# Altium project VMA_SAUVC26.PrjPcb
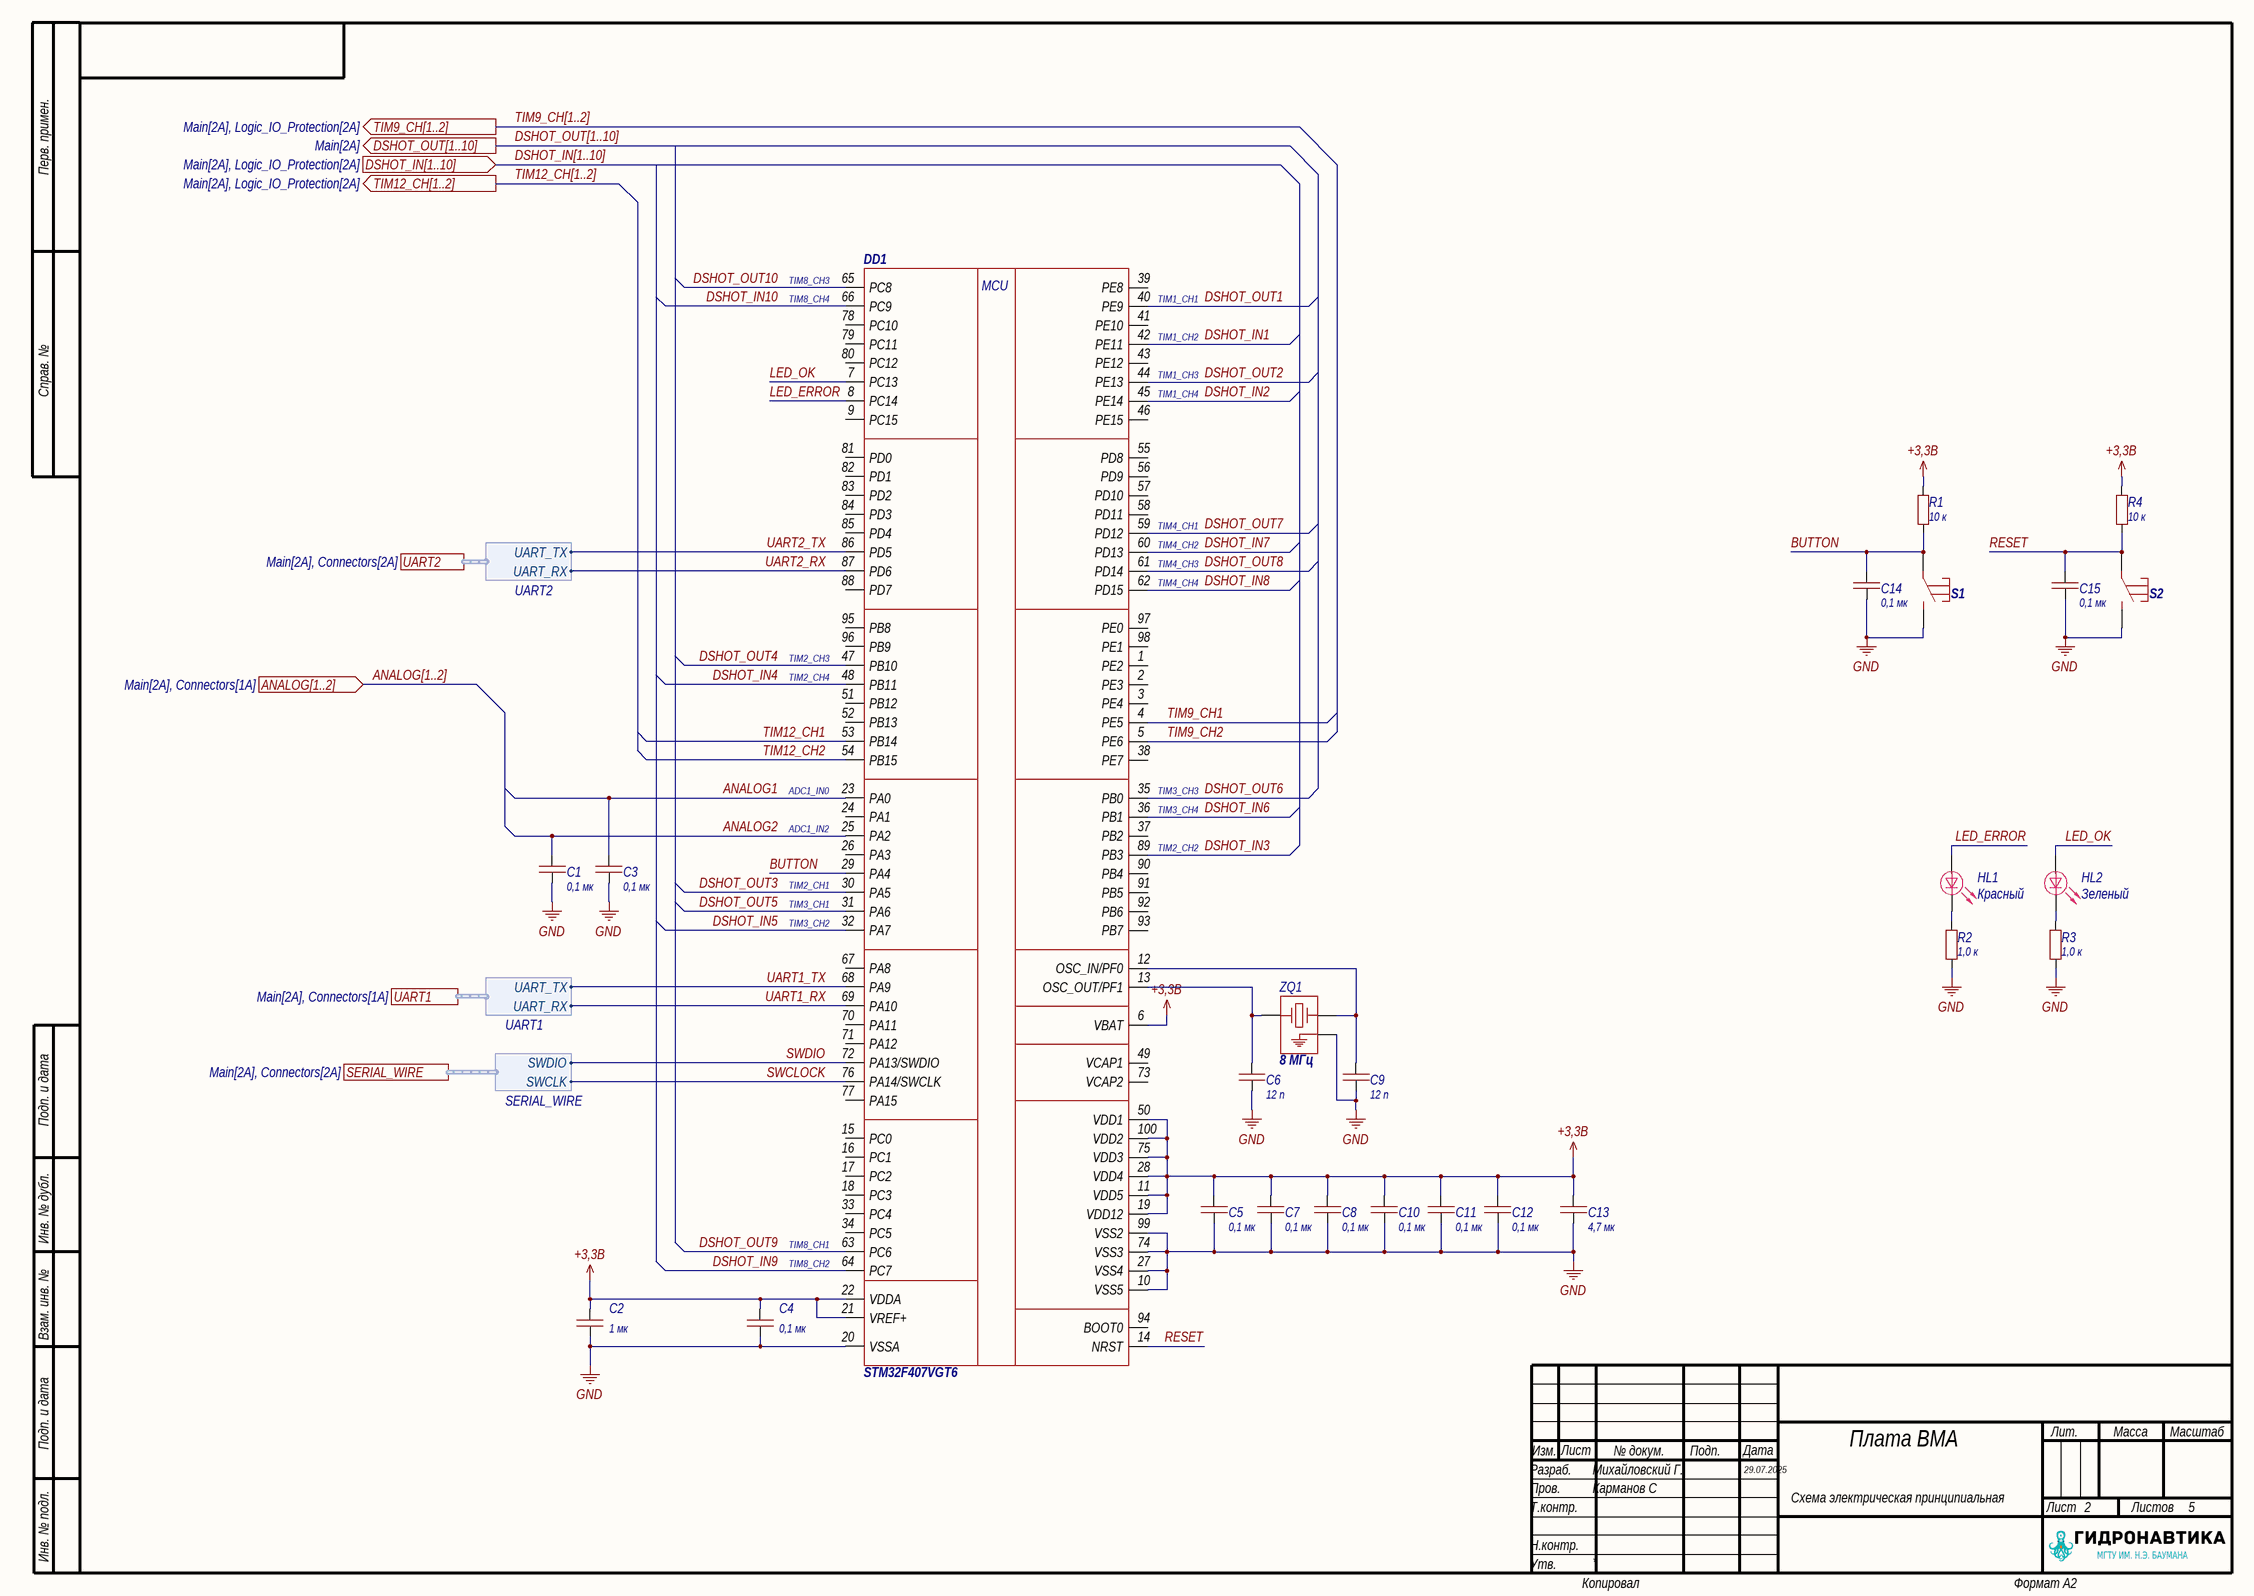
[diagram p0: MCU.SchDoc]
CheckedBy: Карманов С; Decimal_Number_PCB: ГИДР.123456.012; Decimal_Number_Shematic: ГИДР.123456.013; DrawnBy: Михайловский Г.; Release_Date: 29.07.2025; Title: Плата ВМА; Version: 01
4 sheets, 68 parts. Net scope: flat (ports and power ports of the same name join across sheets).
Board file: VMA_SAUVC26.PcbDoc
Sheets:
  MCU.SchDoc
  Connectors.SchDoc
  Logic_IO_Protection.SchDoc
  Main.SchDoc

## Sheet MCU.SchDoc: Плата ВМА
size 594 x 420 mm; SheetNumber: 2; SheetTotal: 5

### Parts
(Parts that share a designator on the sheet are numbered #1, #2 ... from top to bottom, then left to right.)
C1#1  value 0,1 мк  [0603C]  (hidden comment: Capacitor)
C2#1  value 1 мк  [0603C]  (hidden comment: Capacitor)
C3#1  value 0,1 мк  [0603C]  (hidden comment: Capacitor)
C4#1  value 0,1 мк  [0603C]  (hidden comment: Capacitor)
C5#1  value 0,1 мк  [0603C]  (hidden comment: Capacitor)
C6#1  value 12 п  [0603C]  (hidden comment: Capacitor)
C7#1  value 0,1 мк  [0603C]  (hidden comment: Capacitor)
C8#1  value 0,1 мк  [0603C]  (hidden comment: Capacitor)
C9#1  value 12 п  [0603C]  (hidden comment: Capacitor)
C10#1  value 0,1 мк  [0603C]  (hidden comment: Capacitor)
C11  value 0,1 мк  [0603C]  (hidden comment: Capacitor)
C12  value 0,1 мк  [0603C]  (hidden comment: Capacitor)
C13  value 4,7 мк  [1206C]  (hidden comment: Capacitor)
C14  value 0,1 мк  [0603C]  (hidden comment: Capacitor)
C15  value 0,1 мк  [0603C]  (hidden comment: Capacitor)
DD1#1  STM32F407VGT6  [LQFP100]
HL1#1  Color: Красный  [0805D]  (hidden comment: LED)
HL2#1  Color: Зеленый  [0805D]  (hidden comment: LED)
R1#1  value 10 к  [0603R]  (hidden comment: Resistor)
R2#1  value 1,0 к  [0603R]  (hidden comment: Resistor)
R3#1  value 1,0 к  [0603R]  (hidden comment: Resistor)
R4#1  value 10 к  [0603R]  (hidden comment: Resistor)
S1#1  TSS-TD-19XA-XTR  [TSS-TD-19XA-XTR]  (value not drawn)
S2#1  TSS-TD-19XA-XTR  [TSS-TD-19XA-XTR]  (value not drawn)
ZQ1#1  value 8 МГц  [QSMD3.2x2.5]  (hidden comment: XTAL_GND)

### Ports
ANALOG[1..2] (in, see Main[2A], Connectors[1A]), DSHOT_IN[1..10] (in, see Main[2A], Logic_IO_Protection[2A]), DSHOT_OUT[1..10] (out, see Main[2A]), SERIAL_WIRE (harness SERIAL_WIRE, see Main[2A], Connectors[2A]), TIM9_CH[1..2] (out, see Main[2A], Logic_IO_Protection[2A]), TIM12_CH[1..2] (out, see Main[2A], Logic_IO_Protection[2A]), UART1 (harness UART1, see Main[2A], Connectors[1A]), UART2 (harness UART2, see Main[2A], Connectors[2A])

### Harnesses
UART1: UART_TX, UART_RX
SERIAL_WIRE: SWDIO, SWCLK
UART2: UART_TX, UART_RX

### Nets
+3,3В: C2#1.2 C4#1.2 C5#1.2 C7#1.2 C8#1.2 C10#1.2 C11.2 C12.2 C13.2 DD1#1.6(VBAT) DD1#1.11(VDD5) DD1#1.19(VDD12) DD1#1.21(VREF+) DD1#1.22(VDDA) DD1#1.28(VDD4) DD1#1.50(VDD1) DD1#1.75(VDD3) DD1#1.100(VDD2) R1#1.2 R4#1.2
GND: C1#1.1 C2#1.1 C3#1.1 C4#1.1 C5#1.1 C6#1.1 C7#1.1 C8#1.1 C9#1.1 C10#1.1 C11.1 C12.1 C13.1 C14.1 C15.1 DD1#1.10(VSS5) DD1#1.20(VSSA) DD1#1.27(VSS4) DD1#1.74(VSS3) DD1#1.99(VSS2) R2#1.1 R3#1.1 S1#1.2 S2#1.2 ZQ1#1.3
ANALOG1: C3#1.2 DD1#1.23(PA0)
ANALOG2: C1#1.2 DD1#1.25(PA2)
BUTTON: C14.2 DD1#1.29(PA4) R1#1.1 S1#1.1
DSHOT_IN1: DD1#1.42(PE11)
DSHOT_IN2: DD1#1.45(PE14)
DSHOT_IN3: DD1#1.89(PB3)
DSHOT_IN4: DD1#1.48(PB11)
DSHOT_IN5: DD1#1.32(PA7)
DSHOT_IN6: DD1#1.36(PB1)
DSHOT_IN7: DD1#1.60(PD13)
DSHOT_IN8: DD1#1.62(PD15)
DSHOT_IN9: DD1#1.64(PC7)
DSHOT_IN10: DD1#1.66(PC9)
DSHOT_OUT1: DD1#1.40(PE9)
DSHOT_OUT2: DD1#1.44(PE13)
DSHOT_OUT3: DD1#1.30(PA5)
DSHOT_OUT4: DD1#1.47(PB10)
DSHOT_OUT5: DD1#1.31(PA6)
DSHOT_OUT6: DD1#1.35(PB0)
DSHOT_OUT7: DD1#1.59(PD12)
DSHOT_OUT8: DD1#1.61(PD14)
DSHOT_OUT9: DD1#1.63(PC6)
DSHOT_OUT10: DD1#1.65(PC8)
LED_ERROR: DD1#1.8(PC14) HL1#1.1
LED_OK: DD1#1.7(PC13) HL2#1.1
RESET: C15.2 DD1#1.14(NRST) R4#1.1 S2#1.1
SWCLOCK: DD1#1.76(PA14/SWCLK) ; port SERIAL_WIRE.SWCLK
SWDIO: DD1#1.72(PA13/SWDIO) ; port SERIAL_WIRE.SWDIO
TIM9_CH1: DD1#1.4(PE5)
TIM9_CH2: DD1#1.5(PE6)
TIM12_CH1: DD1#1.53(PB14)
TIM12_CH2: DD1#1.54(PB15)
UART1_RX: DD1#1.69(PA10) ; port UART1.UART_RX
UART1_TX: DD1#1.68(PA9) ; port UART1.UART_TX
UART2_RX: DD1#1.87(PD6) ; port UART2.UART_RX
UART2_TX: DD1#1.86(PD5) ; port UART2.UART_TX
NetC6#1_2: C6#1.2 DD1#1.13(OSC_OUT/PF1) ZQ1#1.1
NetC9#1_2: C9#1.2 DD1#1.12(OSC_IN/PF0) ZQ1#1.2
NetHL1#1_2: HL1#1.2 R2#1.2
NetHL2#1_2: HL2#1.2 R3#1.2

Not connected (* = marked no-connect by the designer): DD1#1 1(PE2) 2(PE3) 3(PE4) 9(PC15) 15(PC0) 16(PC1) 17(PC2) 18(PC3) 24(PA1) 26(PA3) 33(PC4) 34(PC5) 37(PB2) 38(PE7) 39(PE8) 41(PE10) 43(PE12) 46(PE15) 49(VCAP1) 51(PB12) 52(PB13) 55(PD8) 56(PD9) 57(PD10) 58(PD11) 67(PA8) 70(PA11) 71(PA12) 73(VCAP2) 77(PA15) 78(PC10) 79(PC11) 80(PC12) 81(PD0) 82(PD1) 83(PD2) 84(PD3) 85(PD4) 88(PD7) 90(PB4) 91(PB5) 92(PB6) 93(PB7) 94(BOOT0) 95(PB8) 96(PB9) 97(PE0) 98(PE1)

### Buses and harness runs
bus ANALOG[1..2] = port ANALOG[1..2]
bus DSHOT_IN[1..10] = port DSHOT_IN[1..10]
bus DSHOT_OUT[1..10] = port DSHOT_OUT[1..10]
bus TIM9_CH[1..2] = port TIM9_CH[1..2]
bus TIM12_CH[1..2] = port TIM12_CH[1..2]

### Notes on the sheet
- (near DD1#1) TIM8_CH3
- (near DD1#1) TIM8_CH4
- (near DD1#1) TIM1_CH1
- (near DD1#1) TIM1_CH2
- (near DD1#1) TIM1_CH3
- (near DD1#1) TIM1_CH4
- (near DD1#1) TIM4_CH1
- (near DD1#1) TIM4_CH2
- (near DD1#1) TIM4_CH3
- (near DD1#1) TIM4_CH4
- (near DD1#1) TIM2_CH3
- (near DD1#1) TIM2_CH4
- (near DD1#1) ADC1_IN0
- (near DD1#1) TIM3_CH3
- (near DD1#1) ADC1_IN2
- (near DD1#1) TIM3_CH4
- (near DD1#1) TIM2_CH1
- (near DD1#1) TIM2_CH2
- (near DD1#1) TIM3_CH1
- (near DD1#1) TIM3_CH2
- (near DD1#1) TIM8_CH1
- (near DD1#1) TIM8_CH2
- Перв. примен.
- Справ. №
- Подп. и дата
- Инв. № дубл.
- Взам. инв. №
- Разраб.
- Изм.
- Лист
- № докум.
- Подп.
- Дата
- Лит.
- Масса
- Масштаб
- Пров.
- Т.контр.
- Схема электрическая принципиальная
- Листов
- Инв. № подл.
- Утв.
- Н.контр.
- Копировал
- Формат А2
- (in symbol STM32F407VGT6) MCU

### Library data of the parts
C1#1 C3#1 C4#1 C5#1 C7#1 C8#1 C10#1 C11 C12 C14 C15 = Capacitor_0,1u_10_50V_X7R_0603C: Конденсатор; Library Path2: Schematic\Capacitor.SchLib; Tolerance: 0,1; Voltage (V): 50; Dielectric: X7R; Capacity (nF): 100; Part Number: Capacitor_0,1u_10_50V_X7R_0603C
C2#1 = Capacitor_1u_10_50V_X7R_0603C: Конденсатор; Library Path2: Schematic\Capacitor.SchLib; Tolerance: 0,1; Voltage (V): 50; Dielectric: X7R; Capacity (nF): 1000; Part Number: Capacitor_1u_10_50V_X7R_0603C
C6#1 C9#1 = 0,1 мк: Конденсатор 12п; Part Number: Capacitor
C13 = Capacitor_4,7u_10_50V_X7R_1206C: Конденсатор; Library Path2: Schematic\Capacitor.SchLib; Tolerance: 0,1; Voltage (V): 50; Dielectric: X7R; Capacity (nF): 4700; Part Number: Capacitor_4,7u_10_50V_X7R_1206C
DD1#1 = STM32F407VGT6: Микроконтроллер; Part Number: STM32F407VGT6
HL1#1 HL2#1 = LED: Светодиод; Part Number: LED
R1#1 R4#1 = Resistor_10k_1_0603: Резистор номиналом 10 кОм и точностью 1%; Power: *; Part Number: Resistor_10k_1_0603; Tolerance: 1%
R2#1 R3#1 = Resistor_1.0k_1_0603: Резистор номиналом 1,0 кОм и точностью 1%; Power: *; Part Number: Resistor_1.0k_1_0603; Tolerance: 1%
S1#1 S2#1 = TSS-TD-19XA-XTR: Тактовая кнопка; Part Number: TSS-TD-19XA-XTR
ZQ1#1 = XTAL_GND: Кварцевый резонатор с входом земли; Part Number: XTAL_GND

## Sheet Connectors.SchDoc: Плата ВМА
size 420 x 297 mm; SheetNumber: 3; SheetTotal: 5
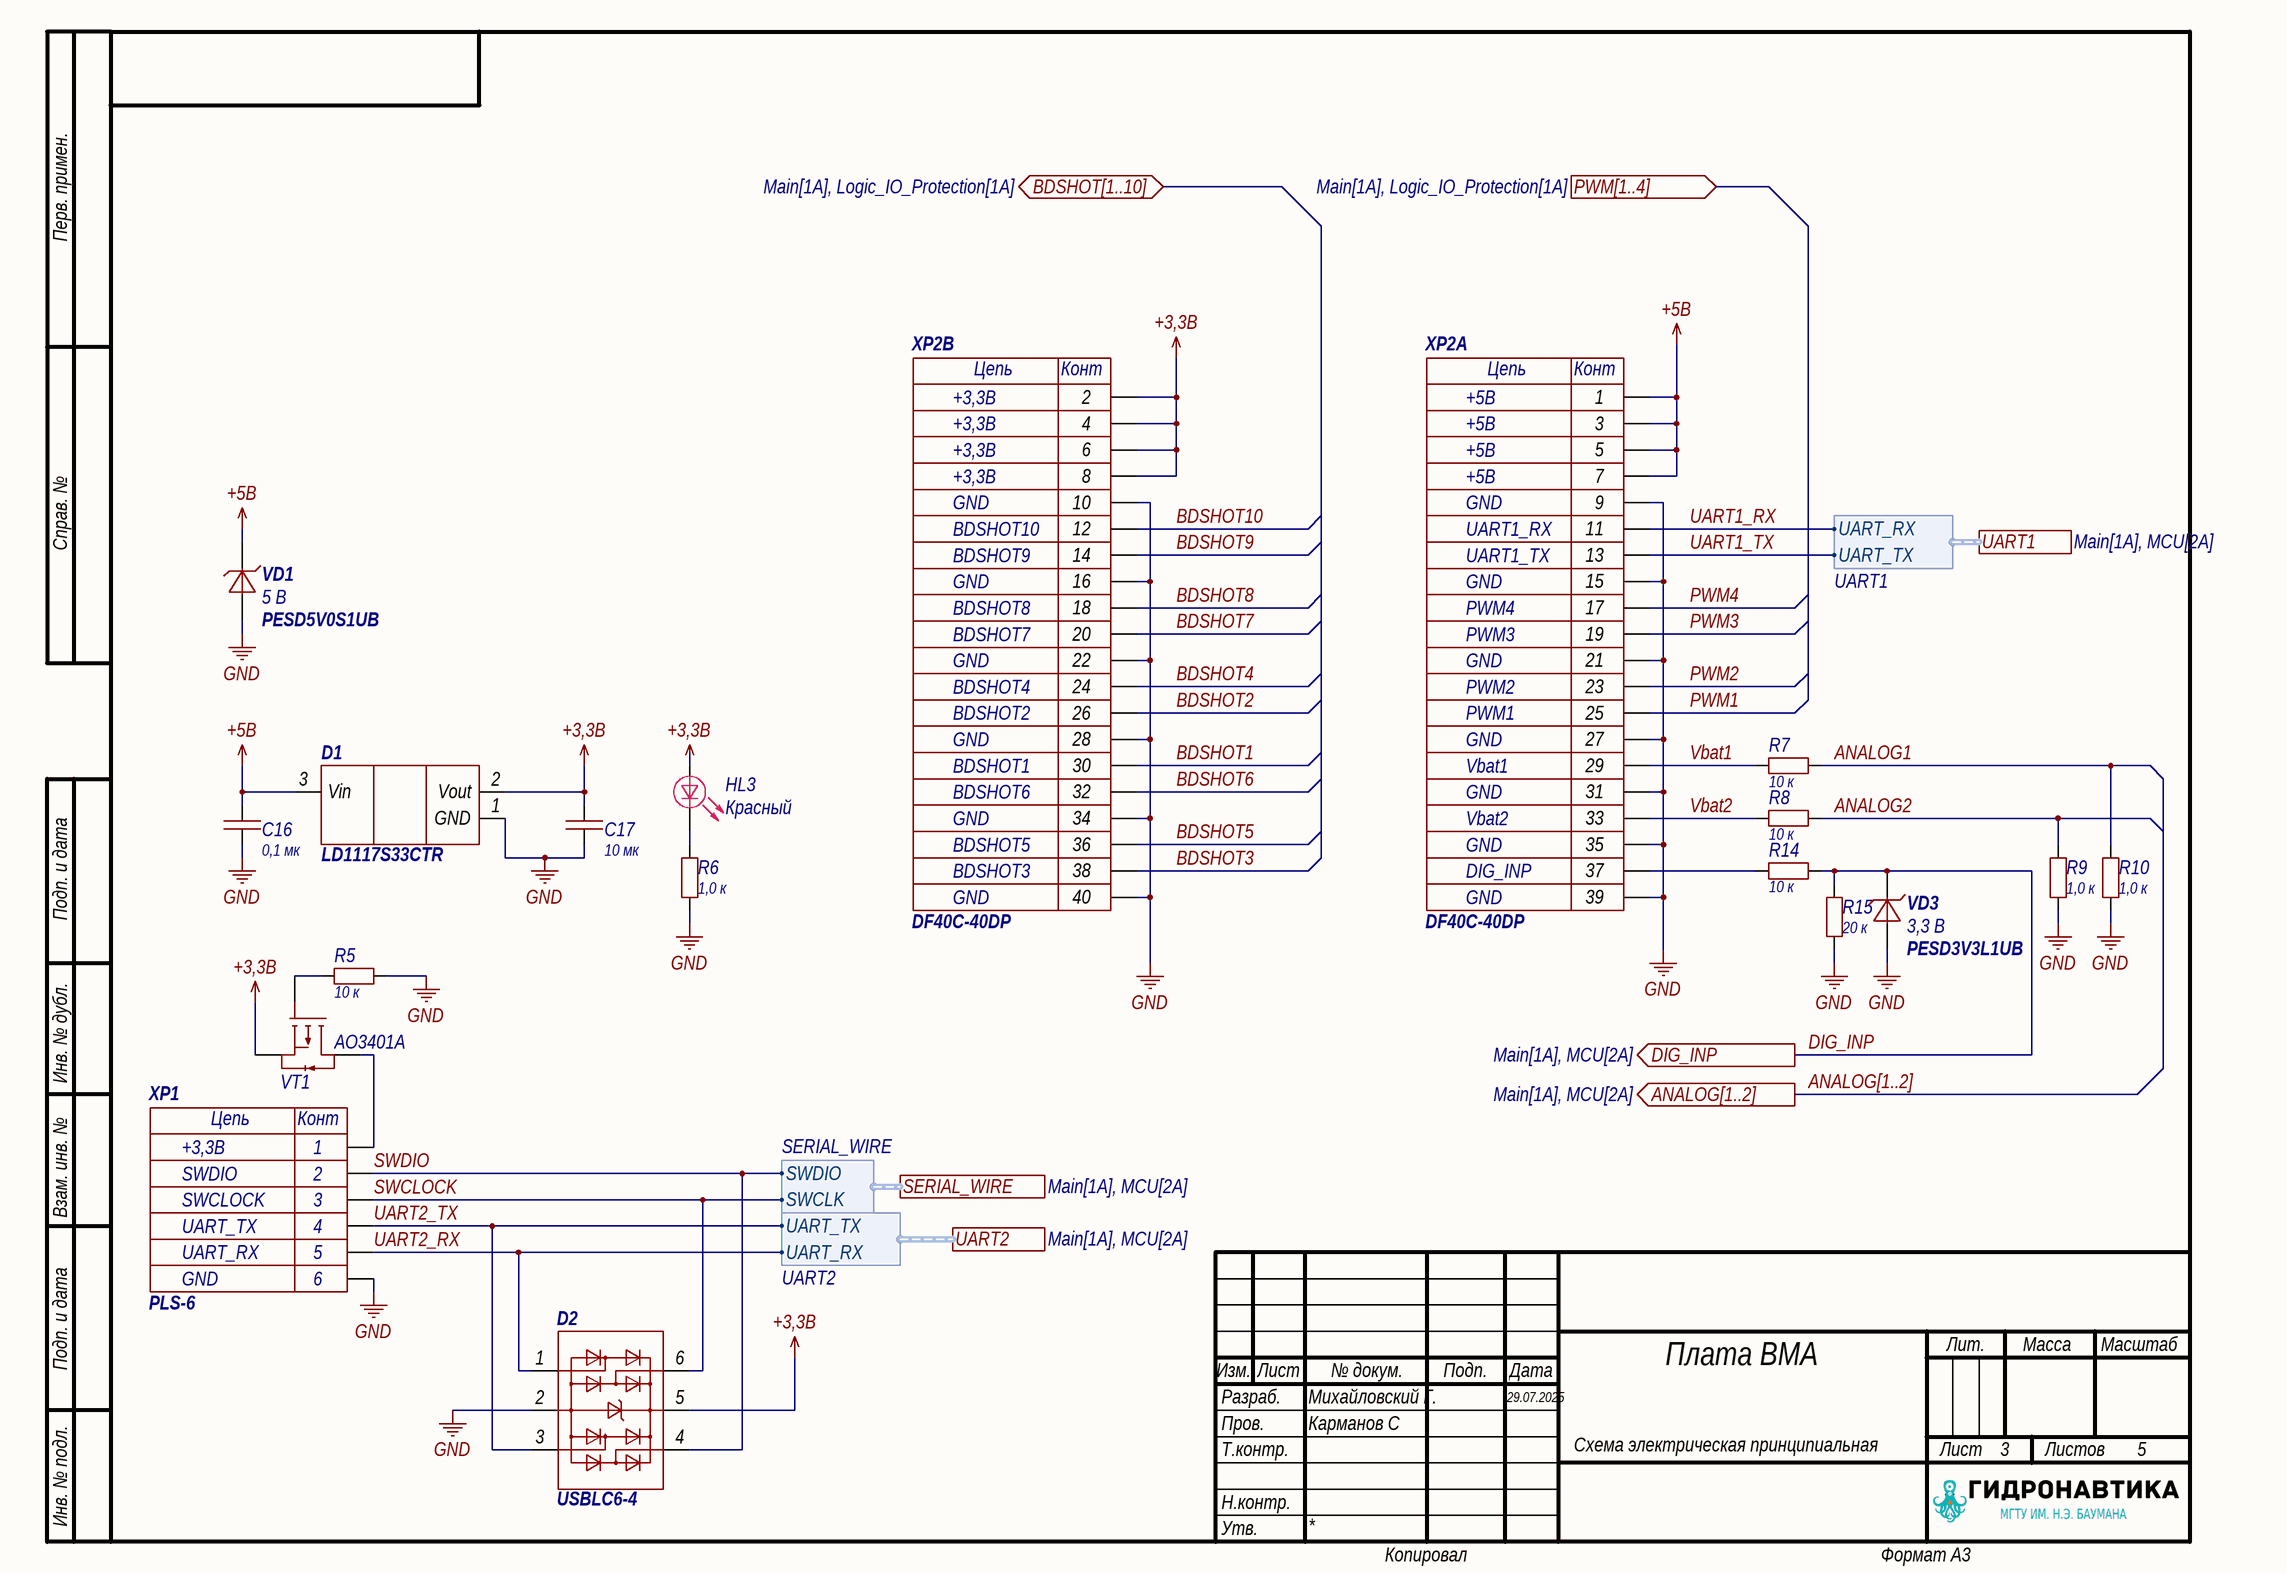
[diagram p1: Connectors.SchDoc]

### Parts
(Parts that share a designator on the sheet are numbered #1, #2 ... from top to bottom, then left to right.)
C16  value 0,1 мк  [0603C]  (hidden comment: Capacitor)
C17  value 10 мк  [1210C]  (hidden comment: Capacitor)
D1#1  LD1117S33CTR  [SOT223]
D2  USBLC6-4  [SOT23-6]
HL3  Color: Красный  [0805D]  (hidden comment: LED)
R5#1  value 10 к  [0603R]  (hidden comment: Resistor)
R6  value 1,0 к  [0603R]  (hidden comment: Resistor)
R7  value 10 к  [0603R]  (hidden comment: Resistor)
R8  value 10 к  [0603R]  (hidden comment: Resistor)
R9  value 1,0 к  [0603R]  (hidden comment: Resistor)
R10  value 1,0 к  [0603R]  (hidden comment: Resistor)
R14  value 10 к  [0603R]  (hidden comment: Resistor)
R15  value 20 к  [0603R]  (hidden comment: Resistor)
VD1  PESD5V0S1UB  value 5 В  [SOD523]
VD3  PESD3V3L1UB  value 3,3 В  [SOD523]
VT1  AO3401A  [SOT23-3]
XP1  PLS-6  Value1: +3,3В  Value2: SWDIO  Value3: SWCLOCK  Value4: UART_TX  Value5: UART_RX  Value6: GND  [PLS6]
XP2  DF40C-40DP  Value17: Vbat2  Value20: GND  Value19: DIG_INP  Value15: Vbat1  Value13: PWM1  Value12: PWM2  Value10: PWM3  Value9: PWM4  Value7: UART1_TX  Value6: UART1_RX  Value4: +5В  [DF40C-40DP]  (parts A,B of 2)

### Ports
ANALOG[1..2] (out, see Main[1A], MCU[2A]), BDSHOT[1..10] (bidir, see Main[1A], Logic_IO_Protection[1A]), DIG_INP (out, see Main[1A], MCU[2A]), PWM[1..4] (in, see Main[1A], Logic_IO_Protection[1A]), SERIAL_WIRE (harness SERIAL_WIRE, see Main[1A], MCU[2A]), UART1 (harness UART1, see Main[1A], MCU[2A]), UART2 (harness UART2, see Main[1A], MCU[2A])

### Harnesses
SERIAL_WIRE: SWDIO, SWCLK
UART2: UART_TX, UART_RX
UART1: UART_RX, UART_TX

### Nets
+3,3В: C17.2 D1#1.2(Vout) D2.5 HL3.1 VT1.2 XP2.2 XP2.4 XP2.6 XP2.8
+5В: C16.2 D1#1.3(Vin) VD1.2 XP2.1 XP2.3 XP2.5 XP2.7
GND: C16.1 C17.1 D1#1.1(GND) D2.2 R5#1.1 R6.1 R9.1 R10.1 R15.1 VD1.1 VD3.1 XP1.6 XP2.9 XP2.10 XP2.15 XP2.16 XP2.21 XP2.22 XP2.27 XP2.28 XP2.31 XP2.34 XP2.35 XP2.39 XP2.40
ANALOG1: R7.2 R10.2
ANALOG2: R8.2 R9.2
BDSHOT1: XP2.30
BDSHOT2: XP2.26
BDSHOT3: XP2.38
BDSHOT4: XP2.24
BDSHOT5: XP2.36
BDSHOT6: XP2.32
BDSHOT7: XP2.20
BDSHOT8: XP2.18
BDSHOT9: XP2.14
BDSHOT10: XP2.12
DIG_INP: R14.2 R15.2 VD3.2 ; port DIG_INP
PWM1: XP2.25
PWM2: XP2.23
PWM3: XP2.19
PWM4: XP2.17
SWCLOCK: D2.6 XP1.3 ; port SERIAL_WIRE.SWCLK
SWDIO: D2.4 XP1.2 ; port SERIAL_WIRE.SWDIO
UART1_RX: XP2.11 ; port UART1.UART_RX
UART1_TX: XP2.13 ; port UART1.UART_TX
UART2_RX: D2.1 XP1.5 ; port UART2.UART_RX
UART2_TX: D2.3 XP1.4 ; port UART2.UART_TX
Vbat1: R7.1 XP2.29
Vbat2: R8.1 XP2.33
NetHL3_2: HL3.2 R6.2
NetR5#1_2: R5#1.2 VT1.1
NetR14_1: R14.1 XP2.37
NetVT1_3: VT1.3 XP1.1

### Buses and harness runs
bus ANALOG[1..2] = port ANALOG[1..2]

### Notes on the sheet
- Перв. примен.
- Справ. №
- Подп. и дата
- Инв. № дубл.
- Взам. инв. №
- Разраб.
- Изм.
- Лист
- № докум.
- Подп.
- Дата
- Лит.
- Масса
- Масштаб
- Пров.
- Т.контр.
- Схема электрическая принципиальная
- Листов
- Инв. № подл.
- Утв.
- Н.контр.
- Копировал
- Формат А3
- (in symbol DF40C-40DP, part A) Цепь; Конт
- (in symbol DF40C-40DP, part B) Цепь; Конт
- (in symbol PLS-6) Цепь; Конт

### Library data of the parts
C16 = Capacitor_0,1u_10_50V_X7R_0603C: as C1#1 on sheet MCU; Part Number: Capacitor_0,1u_10_50V_X7R_0603C
C17 = Capacitor_10u_10_35V_X7R_1210C: Конденсатор; Library Path2: Schematic\Capacitor.SchLib; Tolerance: 0,1; Voltage (V): 35; Dielectric: X7R; Capacity (nF): 10000; Part Number: Capacitor_10u_10_35V_X7R_1210C
D1#1 = LD1117S33CTR: Линейный стабилизатор напряжения; Part Number: LD1117S33CTR
D2 = USBLC6-4: Сборка защитных диодов для USB; ComponentLink1Description: Shop; ComponentLink1URL: https://www.chipdip.ru/product0/8001780508; Part Number: USBLC6-4
HL3 = LED: Светодиод; Part Number: LED
R5#1 R7 R8 = Resistor_10k_1_0603: Резистор номиналом 10 кОм и точностью 1%; Power: *; Part Number: Resistor_10k_1_0603; Tolerance: 1%
R6 R9 R10 = Resistor_1.0k_1_0603: as R2#1 on sheet MCU; Power: *; Part Number: Resistor_1.0k_1_0603; Tolerance: 1%
R14 = Resistor_10k_1_0603: Резистор номиналом 10 кОм 1%; Power: *; Part Number: Resistor_10k_1_0603; Tolerance: 1%
R15 = Resistor_20k_1_0603: Резистор номиналом 20 кОм 1%; Power: *; Part Number: Resistor_20k_1_0603; Tolerance: 1%
VD1 = PESD5V0S1UB: Защитный диод на 5 В, рассеиваемая мощность 330 Вт; Voltage nominal (V): 5; Power (W): 330; Part Number: PESD5V0S1UB
VD3 = PESD3V3L1UB: Защитный диод на 3,3 В, рассеиваемая мощность 45 Вт; Voltage nominal (V): 3,3; Power (W): 45; Автор: glebmih; Part Number: PESD3V3L1UB
VT1 = AO3401A: P-канальный MOSFET; Part Number: AO3401A
XP1 = PLS-6: Гребенка 6 пинов; System: Connector; Part Number: PLS-6
XP2 = DF40C-40DP: Разъем плата-плата 40 пинов, мама, шаг 0.4мм; System: Connector; Value18: GND; Value16: GND; Value14: GND; Value11: GND; Value8: GND; Value5: GND; Value3: +5В; Value2: +5В; Value1: +5В; Part Number: DF40C-40DP

## Sheet Logic_IO_Protection.SchDoc: Плата ВМА
size 420 x 297 mm; SheetNumber: 4; SheetTotal: 5
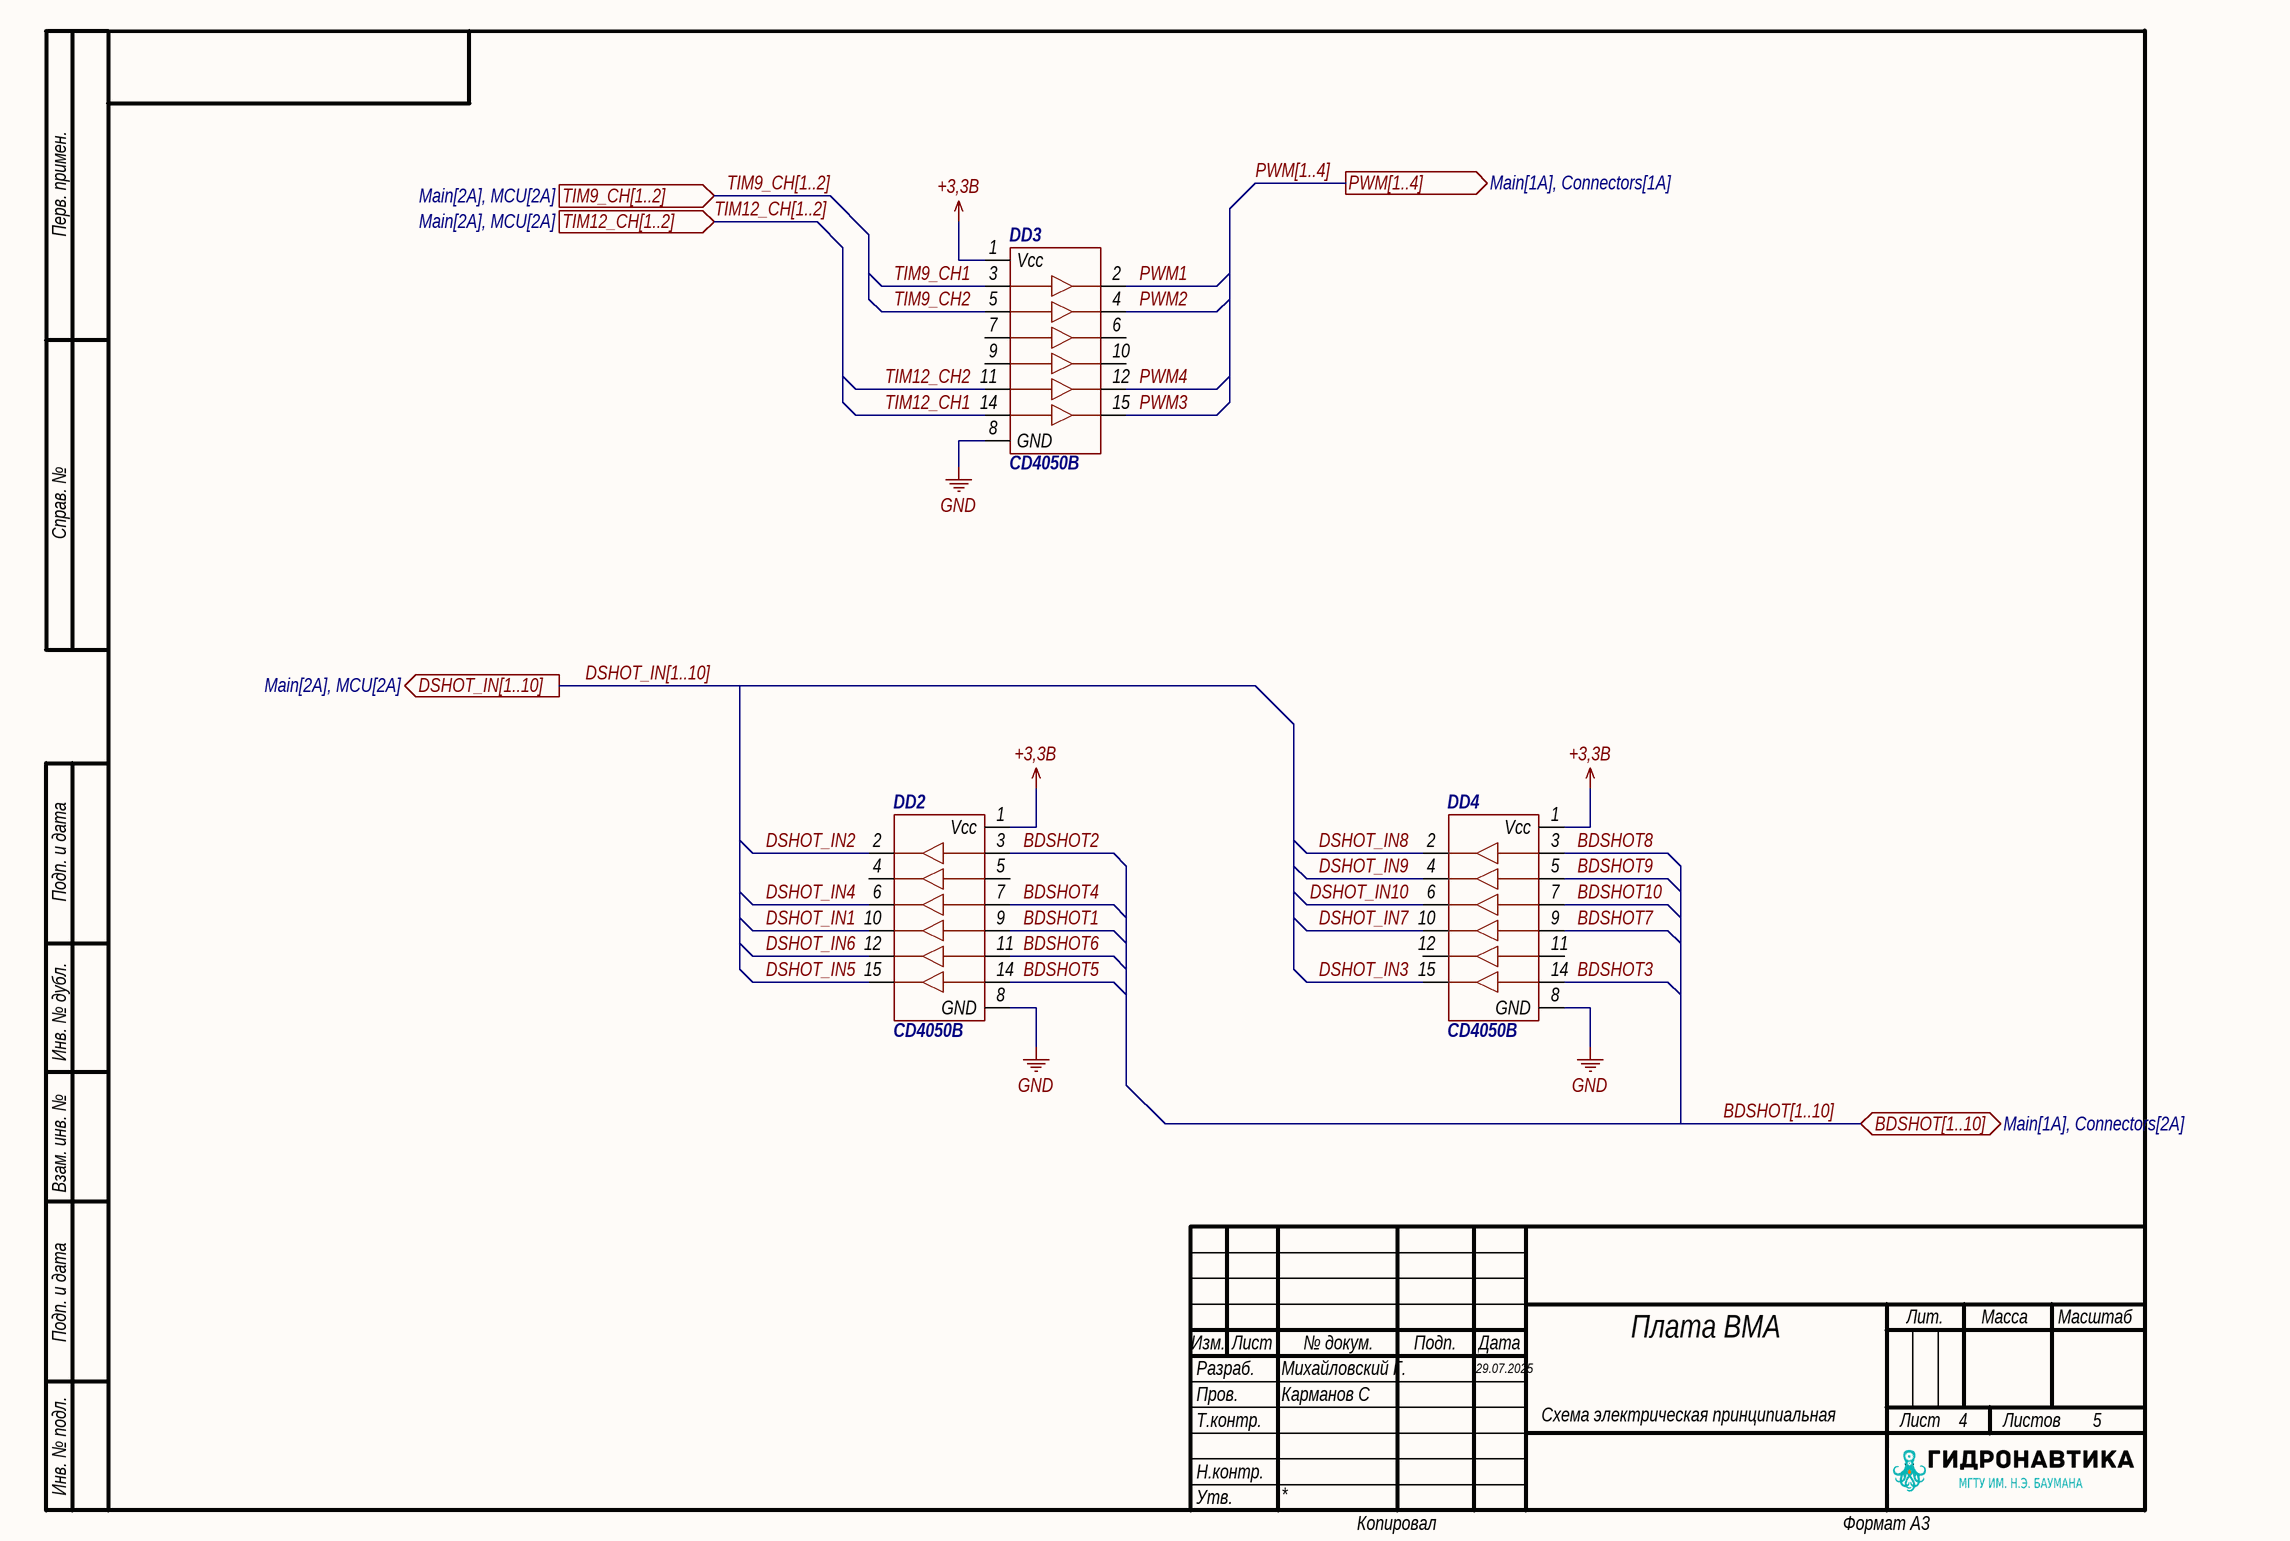
[diagram p2: Logic_IO_Protection.SchDoc]

### Parts
DD2  CD4050B  [SOIC-16]
DD3  CD4050B  [SOIC-16]
DD4  CD4050B  [SOIC-16]

### Ports
BDSHOT[1..10] (bidir, see Main[1A], Connectors[2A]), DSHOT_IN[1..10] (out, see Main[2A], MCU[2A]), PWM[1..4] (out, see Main[1A], Connectors[1A]), TIM9_CH[1..2] (in, see Main[2A], MCU[2A]), TIM12_CH[1..2] (in, see Main[2A], MCU[2A])

### Nets
+3,3В: DD2.1(Vcc) DD3.1(Vcc) DD4.1(Vcc)
GND: DD2.8(GND) DD3.8(GND) DD4.8(GND)
BDSHOT1: DD2.9(A4)
BDSHOT2: DD2.3(A1)
BDSHOT3: DD4.14(A6)
BDSHOT4: DD2.7(A3)
BDSHOT5: DD2.14(A6)
BDSHOT6: DD2.11(A5)
BDSHOT7: DD4.9(A4)
BDSHOT8: DD4.3(A1)
BDSHOT9: DD4.5(A2)
BDSHOT10: DD4.7(A3)
DSHOT_IN1: DD2.10(Y10)
DSHOT_IN2: DD2.2(Y1)
DSHOT_IN3: DD4.15(Y6)
DSHOT_IN4: DD2.6(Y3)
DSHOT_IN5: DD2.15(Y6)
DSHOT_IN6: DD2.12(Y5)
DSHOT_IN7: DD4.10(Y10)
DSHOT_IN8: DD4.2(Y1)
DSHOT_IN9: DD4.4(Y2)
DSHOT_IN10: DD4.6(Y3)
PWM1: DD3.2(Y1)
PWM2: DD3.4(Y2)
PWM3: DD3.15(Y6)
PWM4: DD3.12(Y5)
TIM9_CH1: DD3.3(A1)
TIM9_CH2: DD3.5(A2)
TIM12_CH1: DD3.14(A6)
TIM12_CH2: DD3.11(A5)

Not connected (* = marked no-connect by the designer): DD2 4(Y2) 5(A2); DD3 6(Y3) 7(A3) 9(A4) 10(Y10); DD4 11(A5) 12(Y5)

### Buses and harness runs
bus BDSHOT[1..10] = port BDSHOT[1..10]
bus DSHOT_IN[1..10] = port DSHOT_IN[1..10]
bus PWM[1..4] = port PWM[1..4]
bus TIM9_CH[1..2] = port TIM9_CH[1..2]
bus TIM12_CH[1..2] = port TIM12_CH[1..2]

### Notes on the sheet
- Перв. примен.
- Справ. №
- Подп. и дата
- Инв. № дубл.
- Взам. инв. №
- Разраб.
- Изм.
- Лист
- № докум.
- Подп.
- Дата
- Лит.
- Масса
- Масштаб
- Пров.
- Т.контр.
- Схема электрическая принципиальная
- Листов
- Инв. № подл.
- Утв.
- Н.контр.
- Копировал
- Формат А3

### Library data of the parts
DD2-DD4 = CD4050B: Шесть буферных элементов; Part Number: CD4050B

## Sheet Main.SchDoc: Плата ВМА
size 420 x 297 mm; SheetNumber: 1; SheetTotal: 2
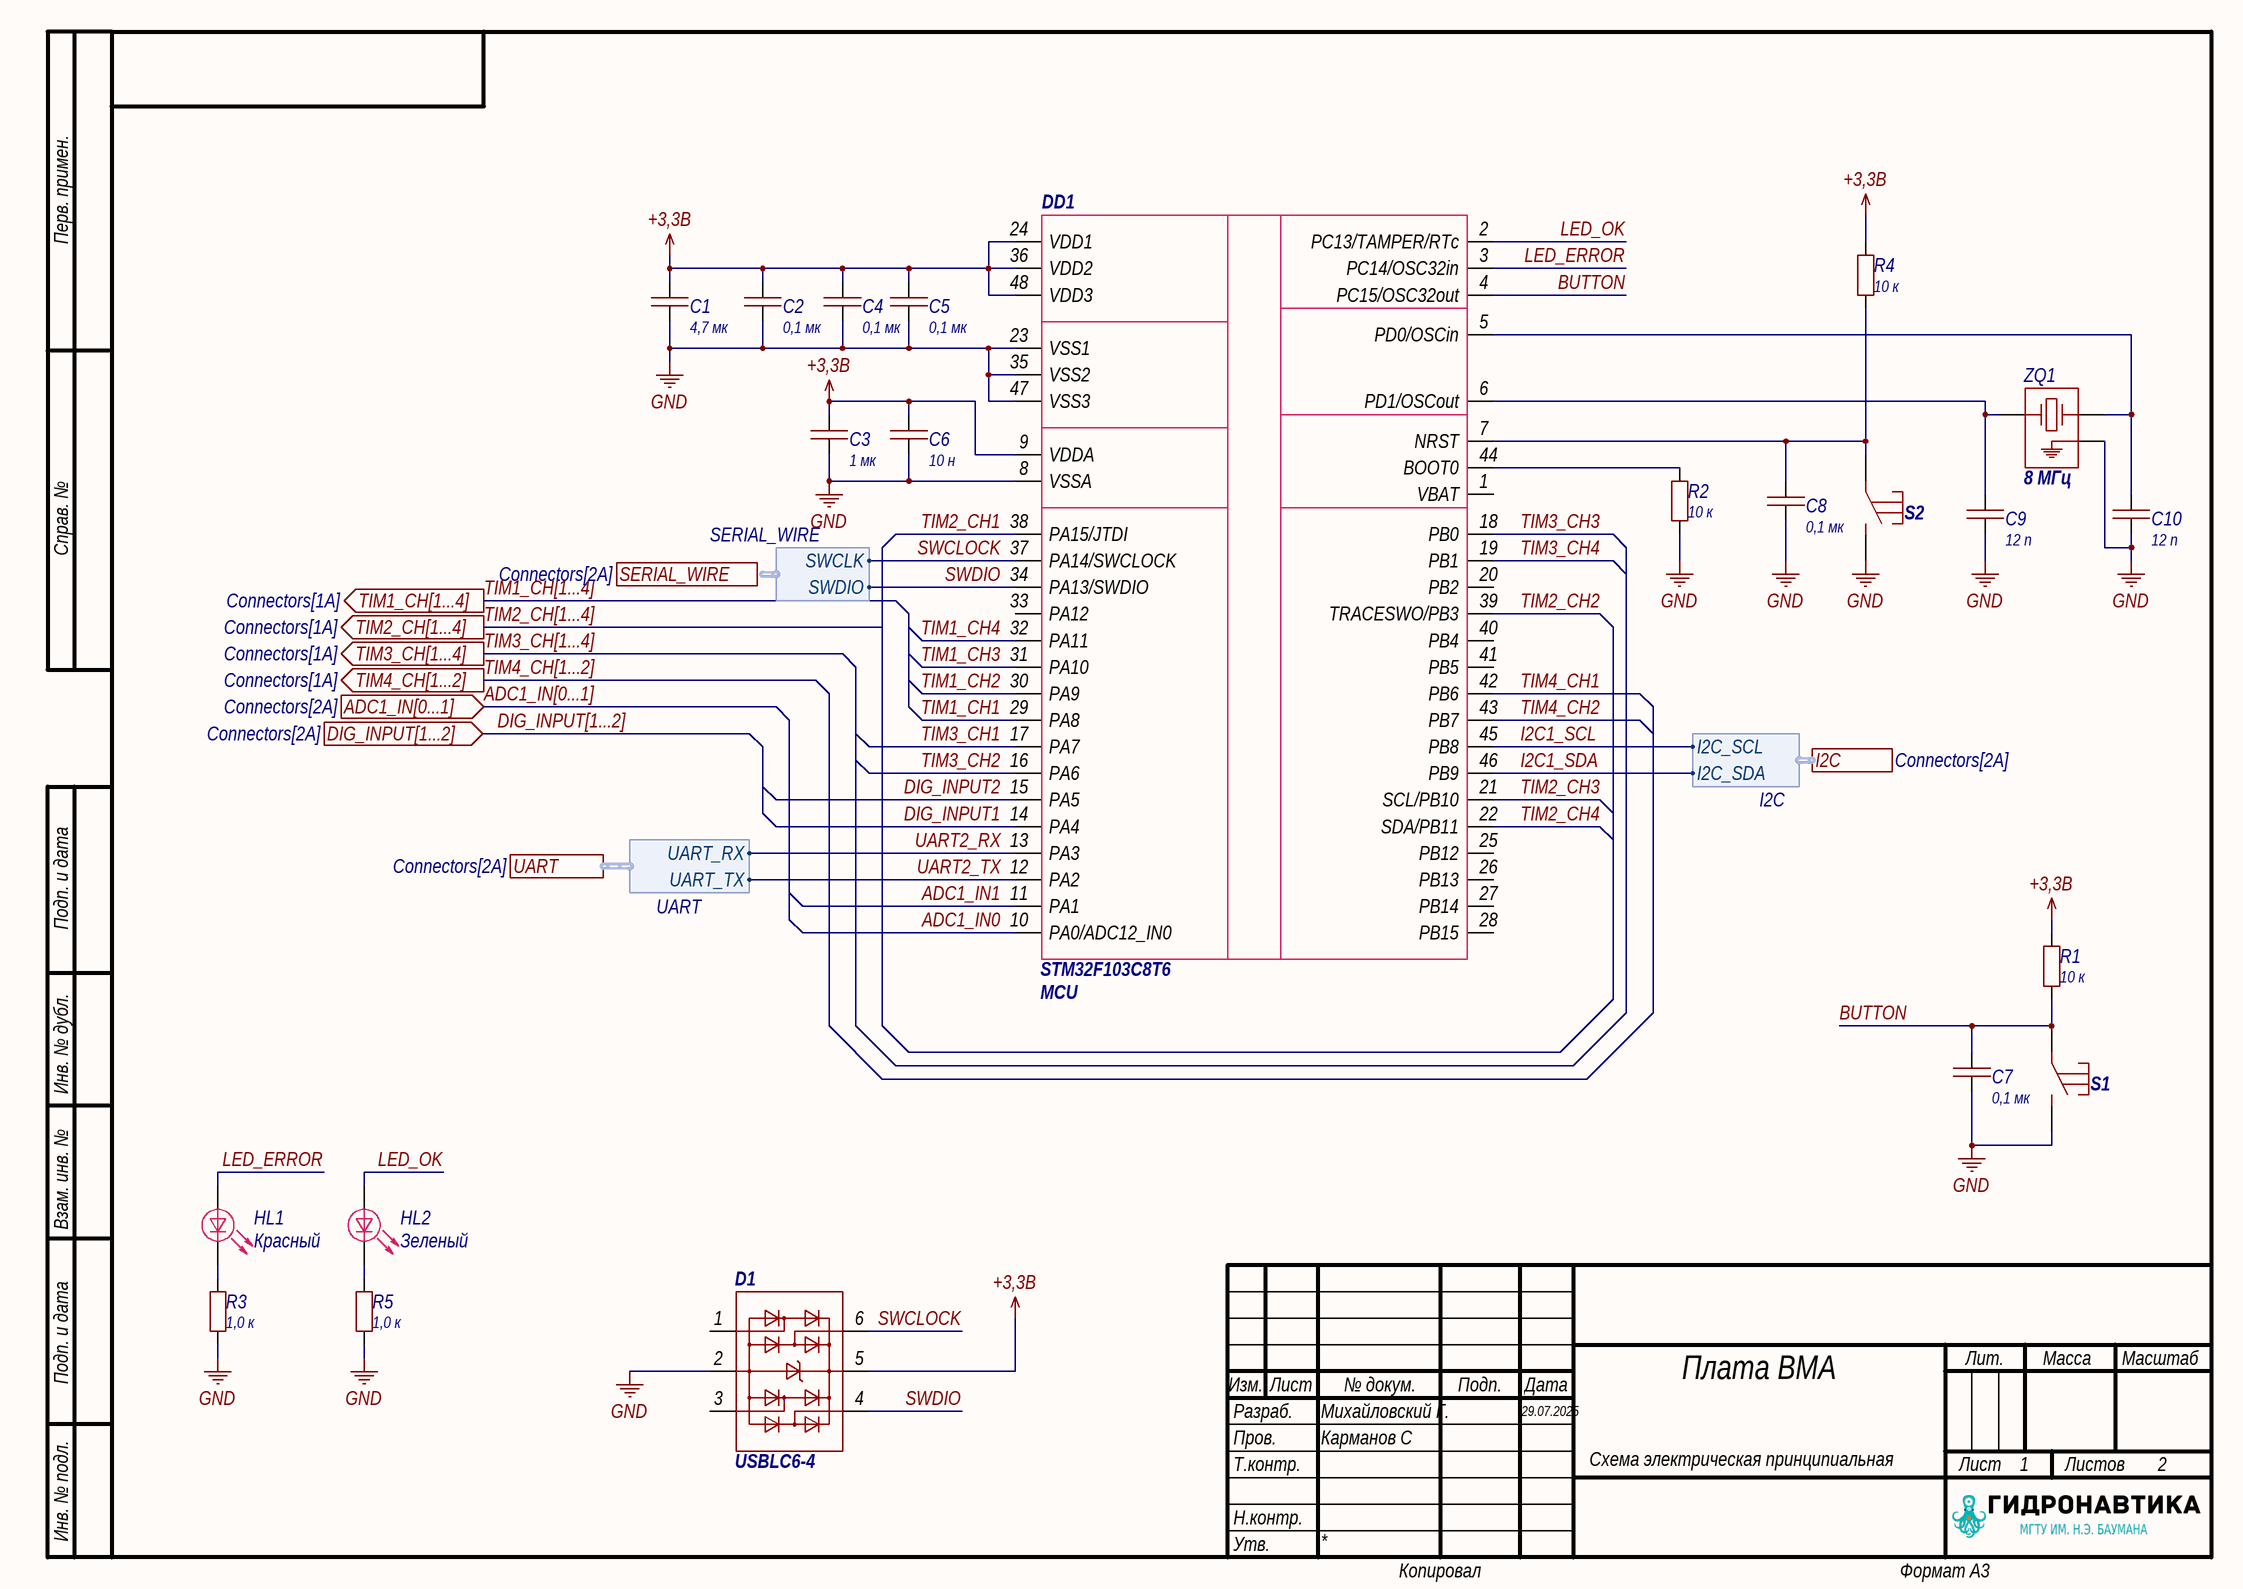
[diagram p3: Main.SchDoc]

### Parts
(Parts that share a designator on the sheet are numbered #1, #2 ... from top to bottom, then left to right.)
C1#2  value 4,7 мк  [1206C]  (hidden comment: Capacitor)
C2#2  value 0,1 мк  [0603C]  (hidden comment: Capacitor)
C3#2  value 1 мк  [0603C]  (hidden comment: Capacitor)
C4#2  value 0,1 мк  [0603C]  (hidden comment: Capacitor)
C5#2  value 0,1 мк  [0603C]  (hidden comment: Capacitor)
C6#2  value 10 н  [0603C]  (hidden comment: Capacitor)
C7#2  value 0,1 мк  [0603C]  (hidden comment: Capacitor)
C8#2  value 0,1 мк  [0603C]  (hidden comment: Capacitor)
C9#2  value 12 п  [0603C]  (hidden comment: Capacitor)
C10#2  value 12 п  [0603C]  (hidden comment: Capacitor)
D1#2  USBLC6-4  [SOT23-6]
DD1#2  STM32F103C8T6  Value1: MCU  [LQFP48]
HL1#2  Color: Красный  [0805D]  (hidden comment: LED)
HL2#2  Color: Зеленый  [0805D]  (hidden comment: LED)
R1#2  value 10 к  [0603R]  (hidden comment: Resistor)
R2#2  value 10 к  [0603R]  (hidden comment: Resistor)
R3#2  value 1,0 к  [0603R]  (hidden comment: Resistor)
R4#2  value 10 к  [0603R]  (hidden comment: Resistor)
R5#2  value 1,0 к  [0603R]  (hidden comment: Resistor)
S1#2  Tact_button  [Button_SMD_10mm]  (value not drawn)
S2#2  Tact_button  [Button_SMD_10mm]  (value not drawn)
ZQ1#2  value 8 МГц  [QSMD3.2x2.5]  (hidden comment: XTAL_GND)

### Ports
ADC1_IN[0...1] (in, see Connectors[2A]), DIG_INPUT[1...2] (in, see Connectors[2A]), I2C (harness I2C, see Connectors[2A]), SERIAL_WIRE (harness SERIAL_WIRE, see Connectors[2A]), TIM1_CH[1...4] (out, see Connectors[1A]), TIM2_CH[1...4] (out, see Connectors[1A]), TIM3_CH[1...4] (out, see Connectors[1A]), TIM4_CH[1...2] (out, see Connectors[1A]), UART (harness UART, see Connectors[2A])

### Harnesses
UART: UART_RX, UART_TX
I2C: I2C_SCL, I2C_SDA
SERIAL_WIRE: SWCLK, SWDIO

### Nets
+3,3В: C1#2.2 C2#2.2 C3#2.2 C4#2.2 C5#2.2 C6#2.2 D1#2.5 DD1#2.9(VDDA) DD1#2.24(VDD1) DD1#2.36(VDD2) DD1#2.48(VDD3) R1#2.2 R4#2.2
GND: C1#2.1 C2#2.1 C3#2.1 C4#2.1 C5#2.1 C6#2.1 C7#2.1 C8#2.1 C9#2.1 C10#2.1 D1#2.2 DD1#2.8(VSSA) DD1#2.23(VSS1) DD1#2.35(VSS2) DD1#2.47(VSS3) R2#2.1 R3#2.1 R5#2.1 S1#2.2 S2#2.2 ZQ1#2.3
ADC1_IN0: DD1#2.10(PA0/ADC12_IN0)
ADC1_IN1: DD1#2.11(PA1)
BUTTON: C7#2.2 DD1#2.4(PC15/OSC32out) R1#2.1 S1#2.1
DIG_INPUT1: DD1#2.14(PA4)
DIG_INPUT2: DD1#2.15(PA5)
I2C1_SCL: DD1#2.45(PB8) ; port I2C.I2C_SCL
I2C1_SDA: DD1#2.46(PB9) ; port I2C.I2C_SDA
LED_ERROR: DD1#2.3(PC14/OSC32in) HL1#2.1
LED_OK: DD1#2.2(PC13/TAMPER/RTc) HL2#2.1
SWCLOCK: D1#2.6 DD1#2.37(PA14/SWCLOCK) ; harness SERIAL_WIRE.SWCLK
SWDIO: D1#2.4 DD1#2.34(PA13/SWDIO) ; harness SERIAL_WIRE.SWDIO
TIM1_CH1: DD1#2.29(PA8)
TIM1_CH2: DD1#2.30(PA9)
TIM1_CH3: DD1#2.31(PA10)
TIM1_CH4: DD1#2.32(PA11)
TIM2_CH1: DD1#2.38(PA15/JTDI)
TIM2_CH2: DD1#2.39(TRACESWO/PB3)
TIM2_CH3: DD1#2.21(SCL/PB10)
TIM2_CH4: DD1#2.22(SDA/PB11)
TIM3_CH1: DD1#2.17(PA7)
TIM3_CH2: DD1#2.16(PA6)
TIM3_CH3: DD1#2.18(PB0)
TIM3_CH4: DD1#2.19(PB1)
TIM4_CH1: DD1#2.42(PB6)
TIM4_CH2: DD1#2.43(PB7)
UART2_RX: DD1#2.13(PA3) ; port UART.UART_RX
UART2_TX: DD1#2.12(PA2) ; port UART.UART_TX
NetC8#2_2: C8#2.2 DD1#2.7(NRST) R4#2.1 S2#2.1
NetC9#2_2: C9#2.2 DD1#2.6(PD1/OSCout) ZQ1#2.1
NetC10#2_2: C10#2.2 DD1#2.5(PD0/OSCin) ZQ1#2.2
NetDD1#2_44: DD1#2.44(BOOT0) R2#2.2
NetHL1#2_2: HL1#2.2 R3#2.2
NetHL2#2_2: HL2#2.2 R5#2.2

Not connected (* = marked no-connect by the designer): D1#2 1(9) 3(11); DD1#2 1(VBAT) 20(PB2) 25(PB12) 26(PB13) 27(PB14) 28(PB15) 33(PA12) 40(PB4) 41(PB5)

### Buses and harness runs
bus ADC1_IN[0...1] = port ADC1_IN[0...1]
bus DIG_INPUT[1...2] = port DIG_INPUT[1...2]
bus TIM1_CH[1...4] = port TIM1_CH[1...4]
bus TIM2_CH[1...4] = port TIM2_CH[1...4]
bus TIM3_CH[1...4] = port TIM3_CH[1...4]
bus TIM4_CH[1...2] = port TIM4_CH[1...2]

### Library data of the parts
C1#2 = Capacitor_4,7u_10_50V_X7R_1206C: as C13 on sheet MCU
C2#2 C4#2 C5#2 C7#2 C8#2 = Capacitor_0,1u_10_50V_X7R_0603C: as C1#1 on sheet MCU
C3#2 = Capacitor_1u_10_50V_X7R_0603C: as C2#1 on sheet MCU
C6#2 = Capacitor_10n_10_50V_X7R_0603C: Конденсатор; Library Path2: Schematic\Capacitor.SchLib; Tolerance: 0,1; Voltage (V): 50; Dielectric: X7R; Capacity (nF): 10
C9#2 C10#2 = 0,1 мк: Конденсатор 12п
D1#2 = USBLC6-4: Сборка защитных диодов для USB
DD1#2 = STM32F103C8T6: Микроконтроллер; Manufacturer: ST Microelectronics; Rate: -0,3...4,0В; Shop: магазин с самой дешевой ценой; Notice: 48 пиновая версия STM32F103
HL1#2 HL2#2 = LED: Светодиод
R1#2 R2#2 R4#2 = Resistor_10k_1_0603: Резистор номиналом 10 кОм и точностью 1%
R3#2 R5#2 = Resistor_1.0k_1_0603: as R2#1 on sheet MCU
S1#2 S2#2 = Tact_button: Тактовая кнопка
ZQ1#2 = XTAL_GND: Кварцевый резонатор с входом земли

## Nets that join several sheets
+3,3В: MCU (20 pins), Connectors (9 pins), Logic_IO_Protection (DD2.1 DD3.1 DD4.1), Main (13 pins)
GND: MCU (25 pins), Connectors (25 pins), Logic_IO_Protection (DD2.8 DD3.8 DD4.8), Main (21 pins)
ANALOG1: MCU (C3#1.2 DD1#1.23), Connectors (R7.2 R10.2)
ANALOG2: MCU (C1#1.2 DD1#1.25), Connectors (R8.2 R9.2)
DSHOT_IN1: MCU (DD1#1.42), Logic_IO_Protection (DD2.10)
DSHOT_IN2: MCU (DD1#1.45), Logic_IO_Protection (DD2.2)
DSHOT_IN3: MCU (DD1#1.89), Logic_IO_Protection (DD4.15)
DSHOT_IN4: MCU (DD1#1.48), Logic_IO_Protection (DD2.6)
DSHOT_IN5: MCU (DD1#1.32), Logic_IO_Protection (DD2.15)
DSHOT_IN6: MCU (DD1#1.36), Logic_IO_Protection (DD2.12)
DSHOT_IN7: MCU (DD1#1.60), Logic_IO_Protection (DD4.10)
DSHOT_IN8: MCU (DD1#1.62), Logic_IO_Protection (DD4.2)
DSHOT_IN9: MCU (DD1#1.64), Logic_IO_Protection (DD4.4)
DSHOT_IN10: MCU (DD1#1.66), Logic_IO_Protection (DD4.6)
SWCLOCK: MCU (DD1#1.76), Connectors (D2.6 XP1.3)
SWDIO: MCU (DD1#1.72), Connectors (D2.4 XP1.2)
TIM9_CH1: MCU (DD1#1.4), Logic_IO_Protection (DD3.3)
TIM9_CH2: MCU (DD1#1.5), Logic_IO_Protection (DD3.5)
TIM12_CH1: MCU (DD1#1.53), Logic_IO_Protection (DD3.14)
TIM12_CH2: MCU (DD1#1.54), Logic_IO_Protection (DD3.11)
UART1_RX: MCU (DD1#1.69), Connectors (XP2.11)
UART1_TX: MCU (DD1#1.68), Connectors (XP2.13)
UART2_RX: MCU (DD1#1.87), Connectors (D2.1 XP1.5)
UART2_TX: MCU (DD1#1.86), Connectors (D2.3 XP1.4)

## Assembly variants
01: not fitted R11_d1 R11_d2 R11_d3 R11_d4 R11_d5 R11_d6 R11_d7 R11_d8 R11_d9 R11_d10 VD2_d1 VD2_d2 VD2_d3 VD2_d4 VD2_d5 VD2_d6 VD2_d7 VD2_d8 VD2_d9 VD2_d10
02: not fitted R12_d1 R12_d2 R12_d3 R12_d4 R12_d5 R12_d6 R12_d7 R12_d8 R12_d9 R12_d10 R13_d1 R13_d2 R13_d3 R13_d4 R13_d5 R13_d6 R13_d7 R13_d8 R13_d9 R13_d10 VT2_d1 VT2_d2 VT2_d3 VT2_d4 VT2_d5 VT2_d6 VT2_d7 VT2_d8 VT2_d9 VT2_d10